# Altium schematic sheet 工装板V4(2)-B.SchDoc
size A3
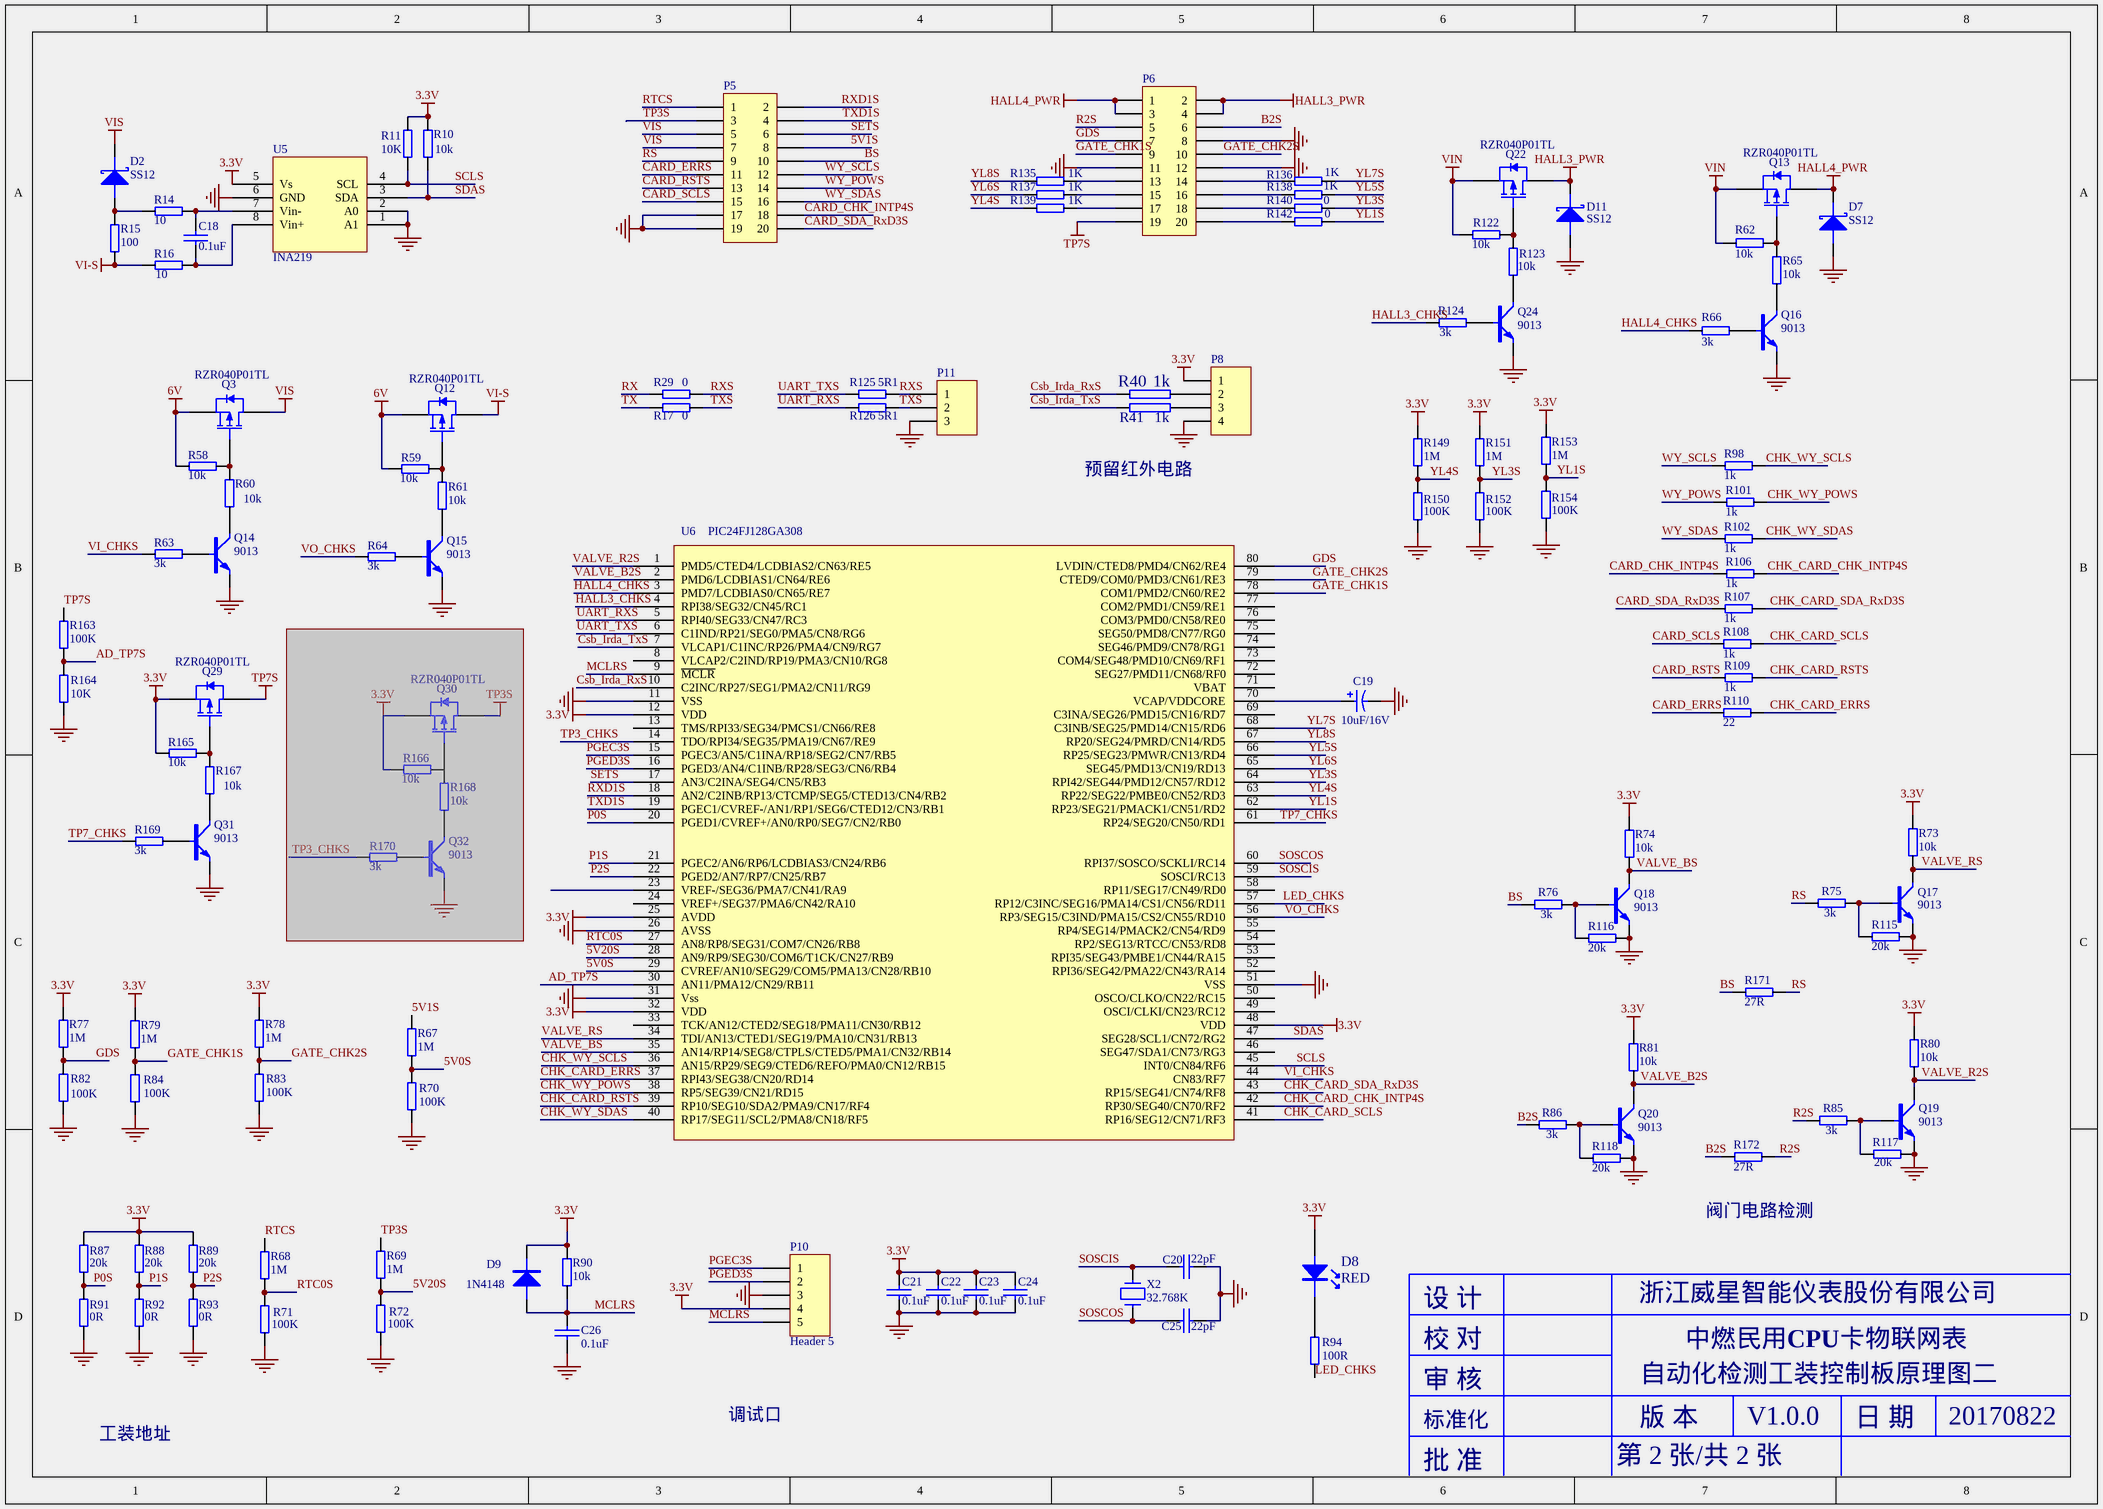
[diagram p0: 工装板V4(2)-B.SchDoc]

## Parts
C18  0.1uF  [C0603]
C19  10uF/16V  [3216]
C20  22pF  [C0603]
C21  0.1uF  [C0603]
C22  0.1uF  [C0603]
C23  0.1uF  [C0603]
C24  0.1uF  [C0603]
C25  22pF  [C0603]
C26  0.1uF  [C0603]
D2  SS12  [DO-214AC]
D7  SS12  [DO-214AC]
D8  RED  [LED-3mm]
D9  1N4148  [LL34]
D11  SS12  [DO-214AC]
P5  (no value)  [PHD254_2X10P]
P6  (no value)  [PHD254_2X10P]
P8  Header 4  [HDR1X4]  (value not drawn)
P10  Header 5  [HDR1X5]
P11  Header 3  [HDR1X3]  (value not drawn)
Q3  RZR040P01TL  [SOT-23-MOS]
Q12  RZR040P01TL  [SOT-23-MOS]
Q13  RZR040P01TL  [SOT-23-MOS]
Q14  9013  [SOT-23-TRAN]
Q15  9013  [SOT-23-TRAN]
Q16  9013  [SOT-23-TRAN]
Q17  9013  [SOT-23-TRAN]
Q18  9013  [SOT-23-TRAN]
Q19  9013  [SOT-23-TRAN]
Q20  9013  [SOT-23-TRAN]
Q22  RZR040P01TL  [SOT-23-MOS]
Q24  9013  [SOT-23-TRAN]
Q29  RZR040P01TL  [SOT-23-MOS]
Q30  RZR040P01TL  [SOT-23-MOS]  (masked out: inside a compile mask, not in the netlist)
Q31  9013  [SOT-23-TRAN]
Q32  9013  [SOT-23-TRAN]  (masked out: inside a compile mask, not in the netlist)
R10  10k  [R0603]
R11  10K  [R0603]
R14  10  [R0603]
R15  100  [R0603]
R16  10  [R0603]
R17  0  [R0603]
R29  0  [R0603]
R40  1k  [R0603]
R41  1k  [R0603]
R58  10k  [R0603]
R59  10k  [R0603]
R60  10k  [R0603]
R61  10k  [R0603]
R62  10k  [R0603]
R63  3k  [R0603]
R64  3k  [R0603]
R65  10k  [R0603]
R66  3k  [R0603]
R67  1M  [R0603]
R68  1M  [R0603]
R69  1M  [R0603]
R70  100K  [R0603]
R71  100K  [R0603]
R72  100K  [R0603]
R73  10k  [R0603]
R74  10k  [R0603]
R75  3k  [R0603]
R76  3k  [R0603]
R77  1M  [R0603]
R78  1M  [R0603]
R79  1M  [R0603]
R80  10k  [R0603]
R81  10k  [R0603]
R82  100K  [R0603]
R83  100K  [R0603]
R84  100K  [R0603]
R85  3k  [R0603]
R86  3k  [R0603]
R87  20k  [R0603]
R88  20k  [R0603]
R89  20k  [R0603]
R90  10k  [R0603]
R91  0R  [R0603]
R92  0R  [R0603]
R93  0R  [R0603]
R94  100R  [R0603]
R98  1k  [R0603]
R101  1k  [R0603]
R102  1k  [R0603]
R106  1k  [R0603]
R107  1k  [R0603]
R108  1k  [R0603]
R109  1k  [R0603]
R110  22  [R0603]
R115  20k  [R0603]
R116  20k  [R0603]
R117  20k  [R0603]
R118  20k  [R0603]
R122  10k  [R0603]
R123  10k  [R0603]
R124  3k  [R0603]
R125  5R1  [R0603]
R126  5R1  [R0603]
R135  1K  [R0603]
R136  1K  [R0603]
R137  1K  [R0603]
R138  1K  [R0603]
R139  1K  [R0603]
R140  0  [R0603]
R142  0  [R0603]
R149  1M  [R0603]
R150  100K  [R0603]
R151  1M  [R0603]
R152  100K  [R0603]
R153  1M  [R0603]
R154  100K  [R0603]
R163  100K  [R0603]
R164  10K  [R0603]
R165  10k  [R0603]
R166  10k  [R0603]  (masked out: inside a compile mask, not in the netlist)
R167  10k  [R0603]
R168  10k  [R0603]  (masked out: inside a compile mask, not in the netlist)
R169  3k  [R0603]
R170  3k  [R0603]  (masked out: inside a compile mask, not in the netlist)
R171  27R  [R1206]
R172  27R  [R1206]
U5  INA219  [SO-8]
U6  PIC24FJ128GA308  [LQFP-80]
X2  32.768K  [XTAL-2S]

## Nets
3.3V: C21.1 C22.1 C23.1 C24.1 D8.1 D9.2(K) P8.1 P10.4 Q29.S R10.2 R11.2 R73.1 R74.1 R77.1 R78.1 R79.1 R80.1 R81.1 R87.1 R88.1 R89.1 R90.1 R149.1 R151.1 R153.1 R165.1 U5.5(Vs) U6.12(VDD) U6.25(AVDD) U6.32(VDD) U6.48(VDD)
6V: Q3.S Q12.S R58.1 R59.2
GND: C19.2 C20.2 C21.2 C22.2 C23.2 C24.2 C25.2 C26.2 D7.1(A) D11.1(A) P5.17 P5.19 P6.8 P6.11 P6.12 P8.4 P10.3 P11.3 Q14.E Q15.E Q16.E Q17.E Q18.E Q19.E Q20.E Q24.E Q31.E R70.2 R71.2 R72.2 R82.2 R83.2 R84.2 R91.1 R92.1 R93.1 R115.2 R116.2 R117.2 R118.2 R150.2 R152.2 R154.2 R164.2 U5.1(A1) U5.2(A0) U5.6(GND) U6.11(VSS) U6.26(AVSS) U6.31(Vss) U6.51(VSS)
HALL3_PWR: D11.2(K) P6.2 P6.4 Q22.D
HALL4_PWR: D7.2(K) P6.1 P6.3 Q13.D
TP7S: P6.19 Q29.D R163.1
VI-S: Q12.D R15.2 R16.2
VIN: Q13.S Q22.S R62.2 R122.2
VIS: D2.2(K) P5.5 P5.7 Q3.D
5V0S: R67.2 R70.1 U6.29(CVREF/AN10/SEG29/COM5/PMA13/CN28/RB10)
5V1S: P5.8 R67.1
5V20S: R69.2 R72.1 U6.28(AN9/RP9/SEG30/COM6/T1CK/CN27/RB9)
AD_TP7S: R163.2 R164.1 U6.30(AN11/PMA12/CN29/RB11)
B2S: P6.6 R86.2 R172.2
BS: P5.10 R76.2 R171.2
CARD_CHK_INTP4S: P5.18 R106.2
CARD_ERRS: P5.11 R110.2
CARD_RSTS: P5.13 R109.2
CARD_SCLS: P5.15 R108.2
CARD_SDA_RxD3S: P5.20 R107.2
CHK_CARD_CHK_INTP4S: R106.1 U6.42(RP30/SEG40/CN70/RF2)
CHK_CARD_ERRS: R110.1 U6.37(RPI43/SEG38/CN20/RD14)
CHK_CARD_RSTS: R109.1 U6.39(RP10/SEG10/SDA2/PMA9/CN17/RF4)
CHK_CARD_SCLS: R108.1 U6.41(RP16/SEG12/CN71/RF3)
CHK_CARD_SDA_RxD3S: R107.1 U6.43(RP15/SEG41/CN74/RF8)
CHK_WY_POWS: R101.2 U6.38(RP5/SEG39/CN21/RD15)
CHK_WY_SCLS: R98.1 U6.36(AN15/RP29/SEG9/CTED6/REFO/PMA0/CN12/RB15)
CHK_WY_SDAS: R102.1 U6.40(RP17/SEG11/SCL2/PMA8/CN18/RF5)
Csb_Irda_RxS: R40.1 U6.10(C2INC/RP27/SEG1/PMA2/CN11/RG9)
Csb_Irda_TxS: R41.1 U6.7(VLCAP1/C1INC/RP26/PMA4/CN9/RG7)
GATE_CHK1S: P6.9 R79.2 R84.1 U6.78(COM1/PMD2/CN60/RE2)
GATE_CHK2S: P6.10 R78.2 R83.1 U6.79(CTED9/COM0/PMD3/CN61/RE3)
GDS: P6.7 R77.2 R82.1 U6.80(LVDIN/CTED8/PMD4/CN62/RE4)
HALL3_CHKS: R124.1 U6.4(RPI38/SEG32/CN45/RC1)
HALL4_CHKS: R66.1 U6.3(PMD7/LCDBIAS0/CN65/RE7)
LED_CHKS: R94.2 U6.57(RP12/C3INC/SEG16/PMA14/CS1/CN56/RD11)
MCLRS: C26.1 D9.1(A) P10.5 R90.2 U6.9(~{MCLR})
P0S: R87.2 R91.2 U6.20(PGED1/CVREF+/AN0/RP0/SEG7/CN2/RB0)
P1S: R88.2 R92.2 U6.21(PGEC2/AN6/RP6/LCDBIAS3/CN24/RB6)
P2S: R89.2 R93.2 U6.22(PGED2/AN7/RP7/CN25/RB7)
PGEC3S: P10.1 U6.15(PGEC3/AN5/C1INA/RP18/SEG2/CN7/RB5)
PGED3S: P10.2 U6.16(PGED3/AN4/C1INB/RP28/SEG3/CN6/RB4)
R2S: P6.5 R85.2 R172.1
RS: P5.9 R75.2 R171.1
RTC0S: R68.2 R71.1 U6.27(AN8/RP8/SEG31/COM7/CN26/RB8)
RTCS: P5.1 R68.1
RX: R29.2
RXD1S: P5.2 U6.18(AN2/C2INB/RP13/CTCMP/SEG5/CTED13/CN4/RB2)
RXS: P11.1 R29.1 R125.1
SCLS: R11.1 U5.4(SCL) U6.45(INT0/CN84/RF6)
SDAS: R10.1 U5.3(SDA) U6.47(SEG28/SCL1/CN72/RG2)
SETS: P5.6 U6.17(AN3/C2INA/SEG4/CN5/RB3)
SOSCIS: C20.1 U6.59(SOSCI/RC13) X2.2
SOSCOS: C25.1 U6.60(RPI37/SOSCO/SCKLI/RC14) X2.1
TP3_CHKS: U6.14(TDO/RPI34/SEG35/PMA19/CN67/RE9)
TP3S: P5.3 R69.1
TP7_CHKS: R169.1 U6.61(RP24/SEG20/CN50/RD1)
TX: R17.2
TXD1S: P5.4 U6.19(PGEC1/CVREF-/AN1/RP1/SEG6/CTED12/CN3/RB1)
TXS: P11.2 R17.1 R126.1
UART_RXS: R126.2 U6.5(RPI40/SEG33/CN47/RC3)
UART_TXS: R125.2 U6.6(C1IND/RP21/SEG0/PMA5/CN8/RG6)
VALVE_B2S: Q20.C R81.2 U6.2(PMD6/LCDBIAS1/CN64/RE6)
VALVE_BS: Q18.C R74.2 U6.35(AN14/RP14/SEG8/CTPLS/CTED5/PMA1/CN32/RB14)
VALVE_R2S: Q19.C R80.2 U6.1(PMD5/CTED4/LCDBIAS2/CN63/RE5)
VALVE_RS: Q17.C R73.2 U6.34(TDI/AN13/CTED1/SEG19/PMA10/CN31/RB13)
VI_CHKS: R63.1 U6.44(CN83/RF7)
VO_CHKS: R64.1 U6.56(RP3/SEG15/C3IND/PMA15/CS2/CN55/RD10)
WY_POWS: P5.14 R101.1
WY_SCLS: P5.12 R98.2
WY_SDAS: P5.16 R102.2
YL1S: R142.1 R153.2 R154.1 U6.62(RP23/SEG21/PMACK1/CN51/RD2)
YL3S: R140.1 R151.2 R152.1 U6.64(RPI42/SEG44/PMD12/CN57/RD12)
YL4S: R137.2 R149.2 R150.1 U6.63(RP22/SEG22/PMBE0/CN52/RD3)
YL5S: R138.1 U6.66(RP25/SEG23/PMWR/CN13/RD4)
YL6S: R139.2 U6.65(SEG45/PMD13/CN19/RD13)
YL7S: R136.1 U6.68(C3INB/SEG25/PMD14/CN15/RD6)
YL8S: R135.2 U6.67(RP20/SEG24/PMRD/CN14/RD5)
NetC18_1: C18.1 R14.1 U5.7(Vin-)
NetC18_2: C18.2 R16.1 U5.8(Vin+)
NetC19_1: C19.1 U6.70(VCAP/VDDCORE)
NetD2_1: D2.1(A) R14.2 R15.1
NetD8_2: D8.2 R94.1
NetP6_13: P6.13 R135.1
NetP6_14: P6.14 R136.2
NetP6_15: P6.15 R139.1
NetP6_16: P6.16 R138.2
NetP6_17: P6.17 R137.1
NetP6_18: P6.18 R140.2
NetP6_20: P6.20 R142.2
NetP8_2: P8.2 R40.2
NetP8_3: P8.3 R41.2
NetQ3_G: Q3.G R58.2 R60.2
NetQ12_G: Q12.G R59.1 R61.2
NetQ13_G: Q13.G R62.1 R65.2
NetQ14_B: Q14.B R63.2
NetQ14_C: Q14.C R60.1
NetQ15_B: Q15.B R64.2
NetQ15_C: Q15.C R61.1
NetQ16_B: Q16.B R66.2
NetQ16_C: Q16.C R65.1
NetQ17_B: Q17.B R75.1 R115.1
NetQ18_B: Q18.B R76.1 R116.1
NetQ19_B: Q19.B R85.1 R117.1
NetQ20_B: Q20.B R86.1 R118.1
NetQ22_G: Q22.G R122.1 R123.2
NetQ24_B: Q24.B R124.2
NetQ24_C: Q24.C R123.1
NetQ29_G: Q29.G R165.2 R167.2
NetQ31_B: Q31.B R169.2
NetQ31_C: Q31.C R167.1

Not connected (* = marked no-connect by the designer): U6 8(VLCAP2/C2IND/RP19/PMA3/CN10/RG8) 13(TMS/RPI33/SEG34/PMCS1/CN66/RE8) 23(VREF-/SEG36/PMA7/CN41/RA9) 24(VREF+/SEG37/PMA6/CN42/RA10) 33(TCK/AN12/CTED2/SEG18/PMA11/CN30/RB12) 46(SEG47/SDA1/CN73/RG3) 49(OSCI/CLKI/CN23/RC12) 50(OSCO/CLKO/CN22/RC15) 52(RPI36/SEG42/PMA22/CN43/RA14) 53(RPI35/SEG43/PMBE1/CN44/RA15) 54(RP2/SEG13/RTCC/CN53/RD8) 55(RP4/SEG14/PMACK2/CN54/RD9) 58(RP11/SEG17/CN49/RD0) 69(C3INA/SEG26/PMD15/CN16/RD7) 71(VBAT) 72(SEG27/PMD11/CN68/RF0) 73(COM4/SEG48/PMD10/CN69/RF1) 74(SEG46/PMD9/CN78/RG1) 75(SEG50/PMD8/CN77/RG0) 76(COM3/PMD0/CN58/RE0) 77(COM2/PMD1/CN59/RE1)

## Notes on the sheet
- 预留红外电路
- (near R172) 阀门电路检测
- 设 计
- 浙江威星智能仪表股份有限公司
- 校 对
- 审 核
- 自动化检测工装控制板原理图二
- 中燃民用CPU卡物联网表
- 工装地址
- 调试口
- 标准化
- 版 本
- V1.0.0
- 日 期
- 20170822
- 批 准
- 第 2 张/共 2 张

## Library data of the parts
C18 C20-C26 = CAP: 无极性电容
C19 = CAP-POL2: 钽电容
D2 D7 D11 = D-Sotk   PASS: 肖特基二极管
D8 = LED
D9 = DIODE
P5 P6 = Header 10X2  PASS: Header, 10-Pin, Dual row
P8 = Header 4: Header, 4-Pin
P10 = Header 5: Header, 5-Pin
P11 = Header 3: Header, 3-Pin
Q3 Q12 Q13 Q22 Q29 Q30 = MOS-P: P-channel  MOSFET
Q14-Q20 Q24 Q31 Q32 = NPN-S: NPN Transistor
R10 R11 R14-R17 R29 R58-R86 R90 R94 R98 R101 R102 R106-R110 R115-R118 R122-R126 R135-R140 R142 R149-R154 R163-R172 = RES
R40 = Pro28.tmp_UnNamed_37
R41 = RES11
R87-R89 R91-R93 = RES: 电阻
U5 = Component_2
U6 = PIC24FJ64GA308
X2 = XTAL1: 晶振,2PIN